# EAGLE design s0httpv9 (EAGLE 7.2.0)
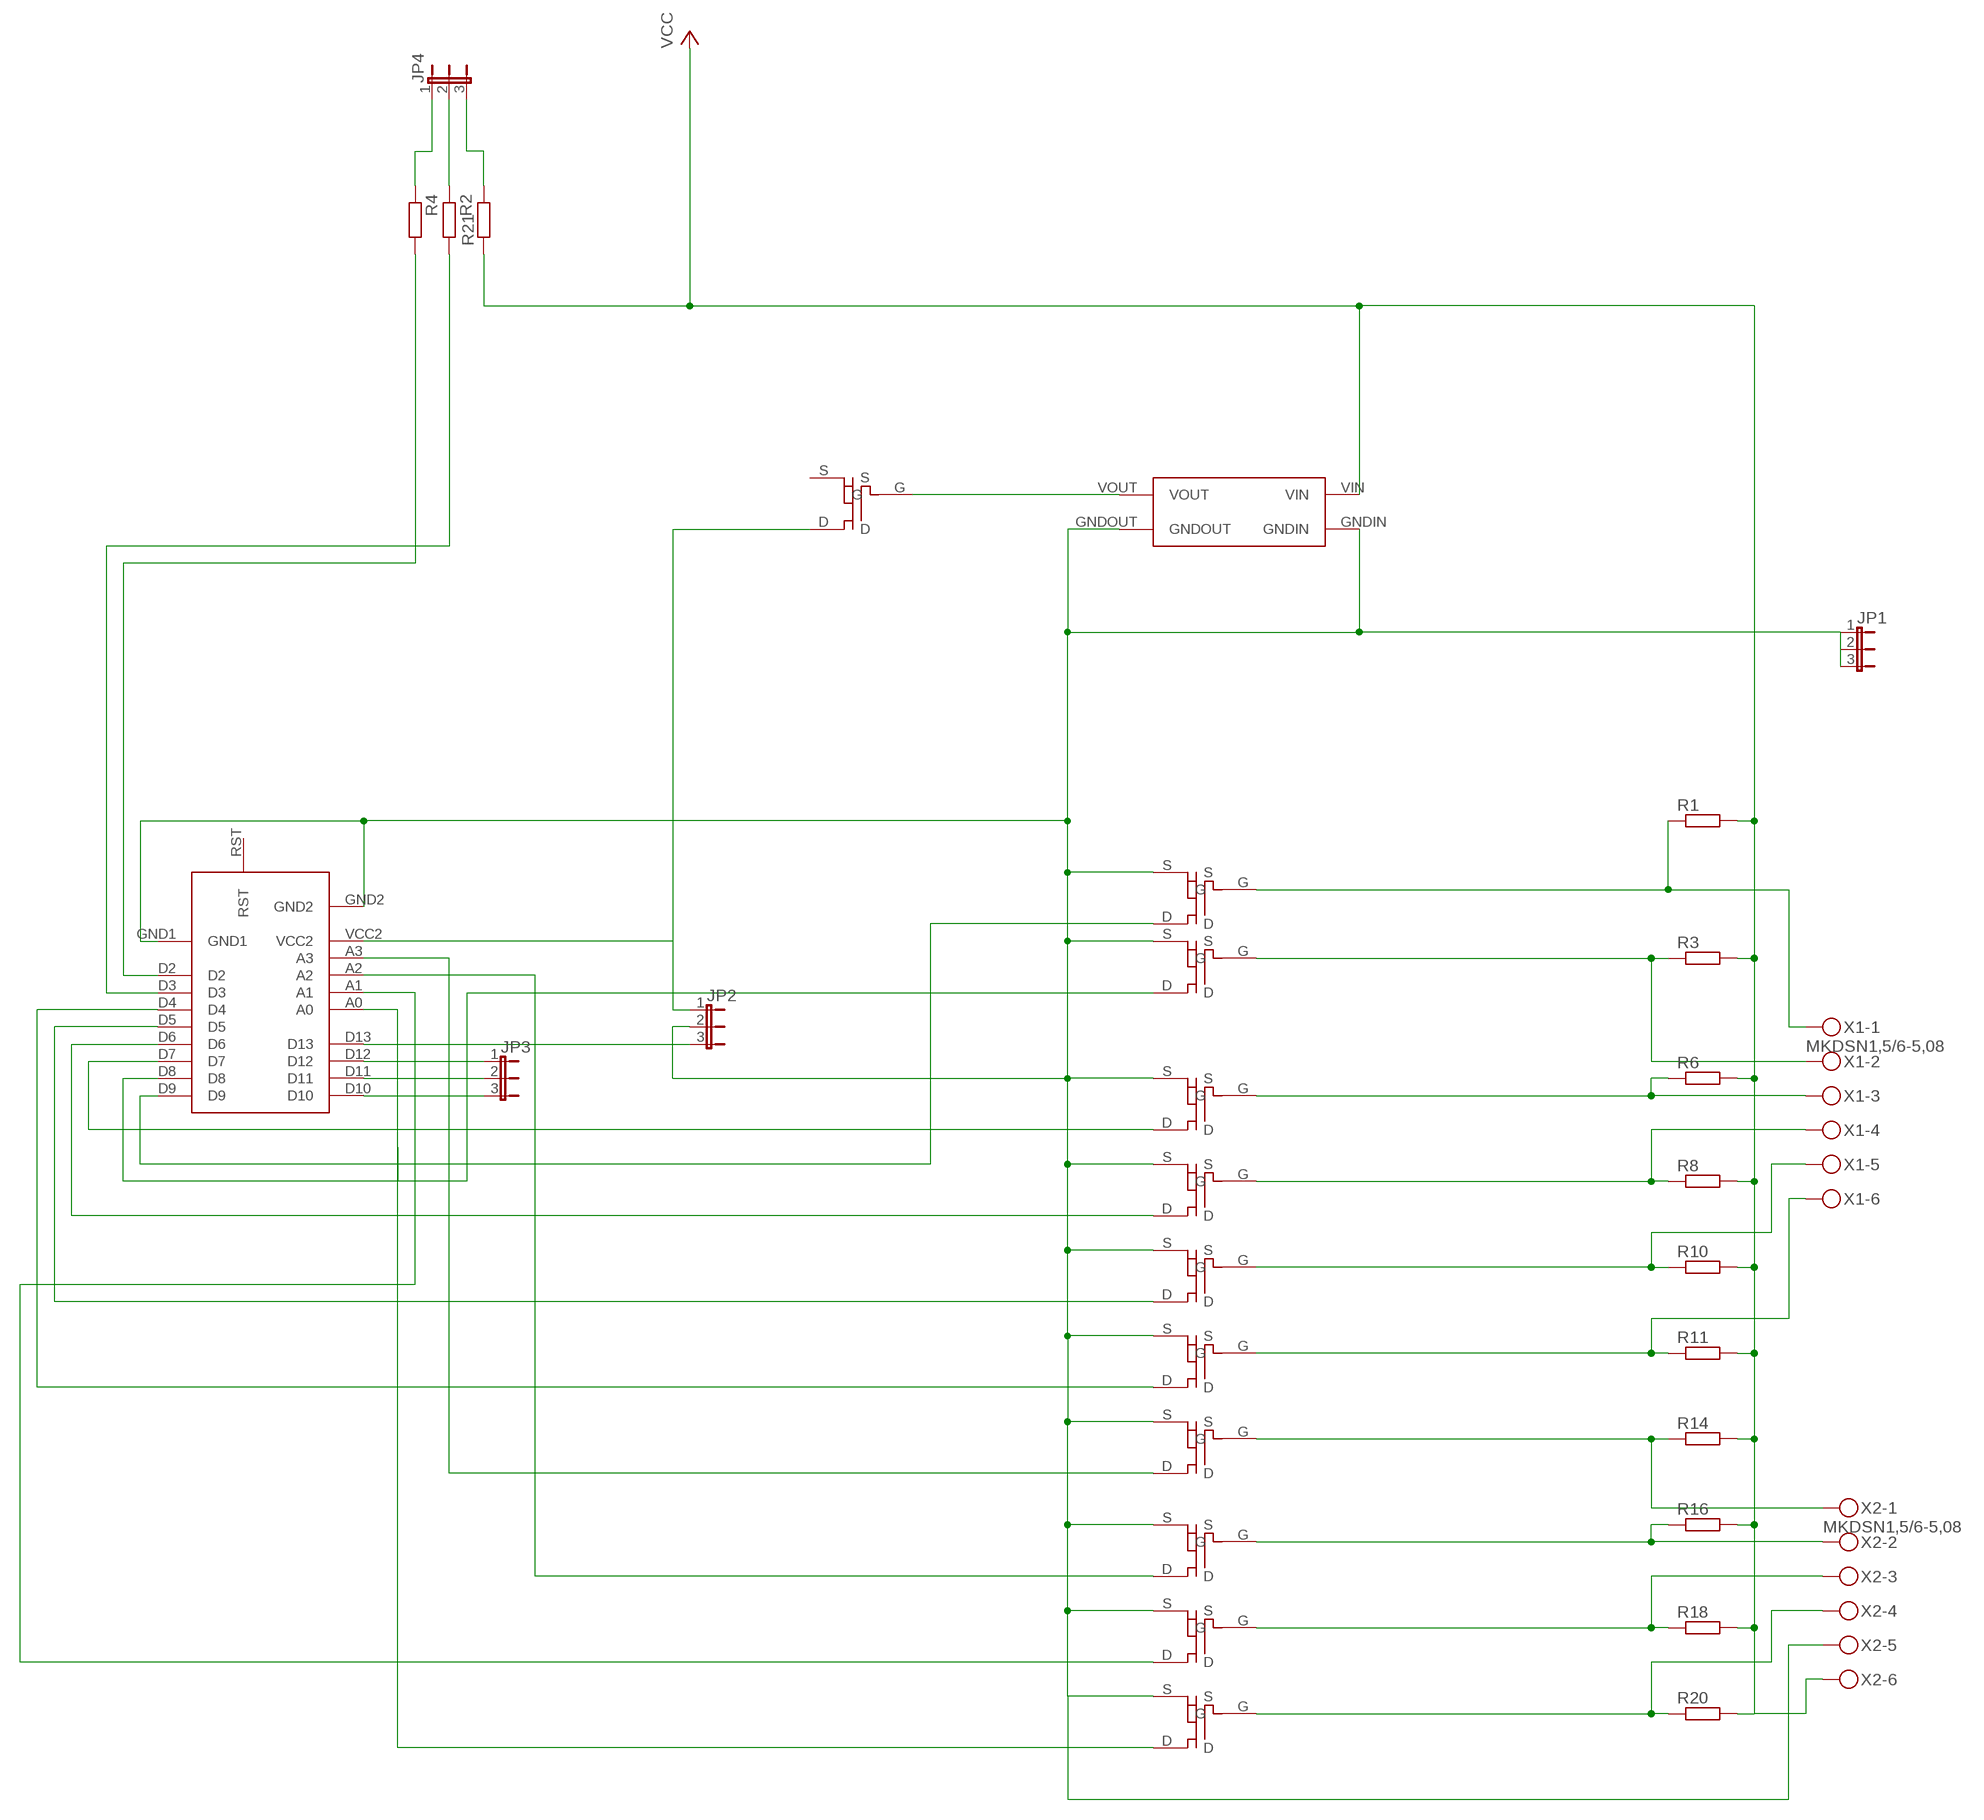
[diagram p0: schematic, sheet 1]

## Parts
JP1  JP2E  [JP2]
JP2  JP2E  [JP2]
JP3  JP2E  [JP2]
JP4  JP2E  [JP2]
R1  R-EU_R0805  [R0805]
R2  R-EU_R0805  [R0805]
R3  R-EU_R0805  [R0805]
R4  R-EU_R0805  [R0805]
R6  R-EU_R0805  [R0805]
R8  R-EU_R0805  [R0805]
R10  R-EU_R0805  [R0805]
R11  R-EU_R0805  [R0805]
R14  R-EU_R0805  [R0805]
R16  R-EU_R0805  [R0805]
R18  R-EU_R0805  [R0805]
R20  R-EU_R0805  [R0805]
R21  R-EU_R0805  [R0805]
U$1  ARDUINOPROMINIREDUCED  [ARDUINOPROMINIREDUCED]
U$2  VREGMODULE  [VREGMODULE]
U$3  MOSFET-TO236  [MOSFET-TO236]
U$4  MOSFET-TO236  [MOSFET-TO236]
U$5  MOSFET-TO236  [MOSFET-TO236]
U$6  MOSFET-TO236  [MOSFET-TO236]
U$7  MOSFET-TO236  [MOSFET-TO236]
U$8  MOSFET-TO236  [MOSFET-TO236]
U$9  MOSFET-TO236  [MOSFET-TO236]
U$10  MOSFET-TO236  [MOSFET-TO236]
U$11  MOSFET-TO236  [MOSFET-TO236]
U$12  MOSFET-TO236  [MOSFET-TO236]
U$13  MOSFET-TO236  [MOSFET-TO236]
X1  MKDSN1,5/6-5,08  [MKDSN1,5/6-5,08]
X2  MKDSN1,5/6-5,08  [MKDSN1,5/6-5,08]

## Nets
GND: JP1.1 JP1.2 JP1.3 JP2.2 U$1.GND1 U$1.GND2 U$2.GNDIN U$2.GNDOUT U$3.S U$4.S U$5.S U$6.S U$7.S U$8.S U$9.S U$10.S U$11.S U$12.S X2.5
N$1: R14.1 U$9.G X2.1
N$2: R10.1 U$7.G X1.5
N$3: JP3.3 U$1.D10
N$4: R16.1 U$10.G X2.2
N$5: R18.1 U$11.G X2.3
N$6: JP3.2 U$1.D11
N$7: JP3.1 U$1.D12
N$8: U$1.D8 U$4.D
N$9: JP2.3 U$1.D13
N$10: U$1.D9 U$3.D
N$12: JP2.1 U$1.VCC2 U$13.D
N$13: U$1.A3 U$9.D
N$14: U$1.D6 U$6.D
N$15: U$1.D5 U$7.D
N$16: U$1.A2 U$10.D
N$17: U$1.D4 U$8.D
N$18: U$1.D7 U$5.D
N$19: U$2.VOUT U$13.G
N$21: U$1.A0 U$12.D
N$22: R1.1 U$3.G X1.1
N$23: R3.1 U$4.G X1.2
N$24: U$1.A1 U$11.D
N$25: R6.1 U$5.G X1.3
N$27: R8.1 U$6.G X1.4
N$28: R11.1 U$8.G X1.6
N$29: JP4.3 R21.2
N$30: R20.1 U$12.G X2.4
N$33: JP4.1 R4.1
N$34: JP4.2 R2.1
N$35: R2.2 U$1.D3
N$37: R4.2 U$1.D2
VCC: R1.2 R3.2 R6.2 R8.2 R10.2 R11.2 R14.2 R16.2 R18.2 R20.2 R21.1 U$2.VIN X2.6
Unconnected: U$1.RST U$13.S

## Library data of the parts
JP1-JP4 = jumper:JP2E: JUMPER
R1-R4 R6 R8 R10 R11 R14 R16 R18 R20 R21 = resistor:R-EU_: RESISTOR, European symbol
U$1 = snulllib:ARDUINOPROMINIREDUCED
U$2 = snulllib:VREGMODULE
U$3-U$13 = snulllib:MOSFET-TO236
X1 X2 = con-phoenix-508:MKDSN1,5/6-5,08: MKDSN 1,5/ 6-5,08 Printklemme Nennstrom: 13,5 A Nennspannung: 250 V Rastermaß: 5,08 mm Polzahl: 6 Anschlussart: Schraubanschluss Montage: Löten Anschlussrichtung Leiter/Platine: 0 ° Artikelnummer: 1729160 Source: http://eshop.phoenixcontact.com .. 1729160.pdf

## Board
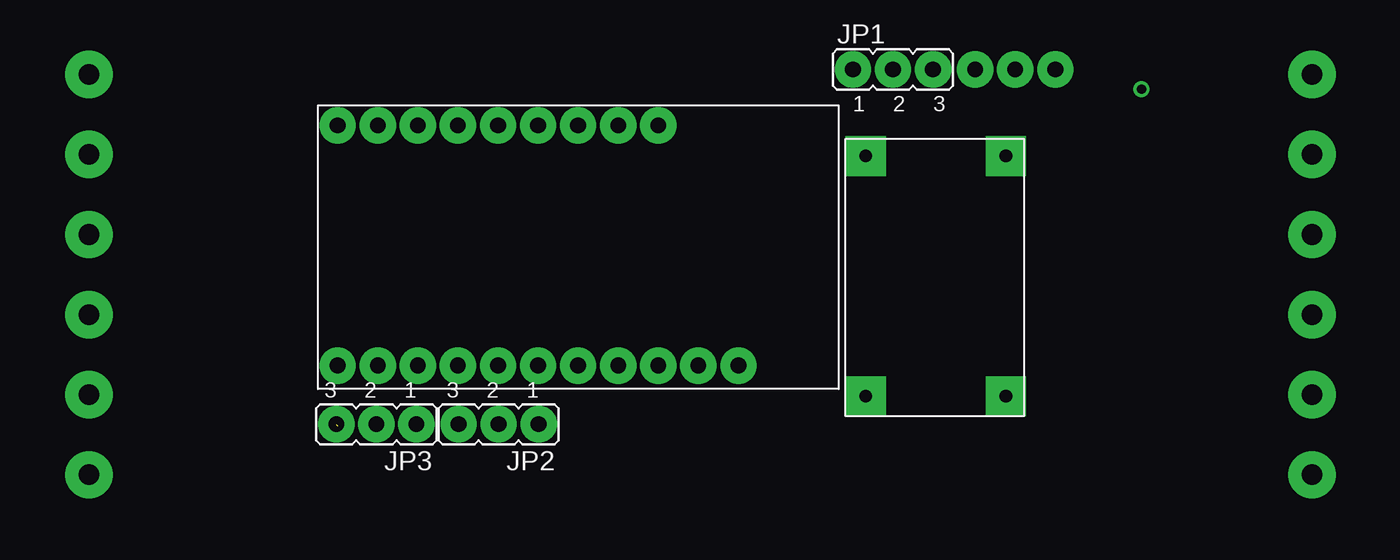
[diagram p1: board, top side]
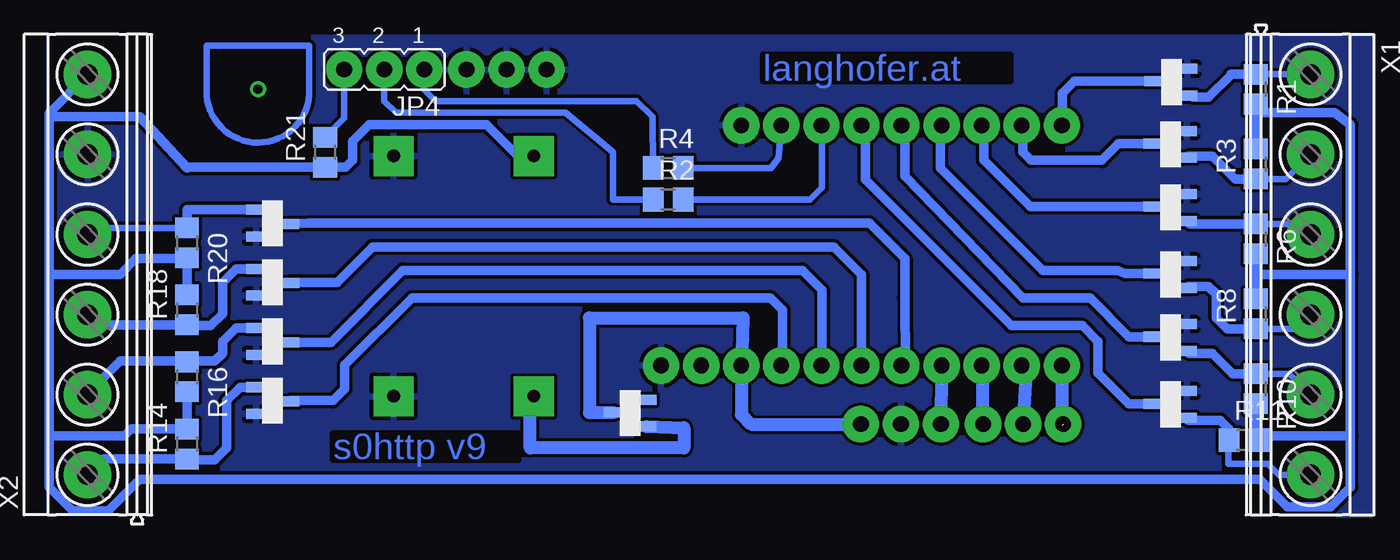
[diagram p2: board, bottom side, seen from below]

No outline drawn. Coordinates in mm, seen from the top.
Copper layers (1*16): Top 0.035mm / dielectric 1.5mm / Bottom 0.035mm
Design rules "default": minimum track width 10mil, minimum drill 24mil, track to track 8mil, track to pad 8mil, pad to pad 8mil, via to via 8mil, smd to smd 8mil, copper to edge 40mil, drill to drill 8mil, minimum pad ring 10mil, minimum via ring 8mil, stop-mask expansion 4mil, vias tented up to drill 0mil, thermal gap 10mil

### Footprints (pad centres in the part's own frame; a part is rotated, then mirrored left to right if it is on the bottom)
JP2 = drill 1 pad 2.3: 1 -2.54,0; 2 0,0; 3 2.54,0
R0805 = smd 1.3 x 1.5: 1 -0.95,0; 2 0.95,0
ARDUINOPROMINIREDUCED = drill 1 pad 2.3: A0 16.51,-21.59; A1 16.51,-19.05; A2 16.51,-16.51; A3 16.51,-13.97; D2 1.27,-13.97; D3 1.27,-16.51; D4 1.27,-19.05; D5 1.27,-21.59; D6 1.27,-24.13; D7 1.27,-26.67; D8 1.27,-29.21; D9 1.27,-31.75; D10 16.51,-31.75; D11 16.51,-29.21; D12 16.51,-26.67; D13 16.51,-24.13; GND1 1.27,-11.43; GND2 16.51,-6.35; RST 16.51,-8.89; VCC2 16.51,-11.43
VREGMODULE = drill 0.8 pad 2.54 square: GNDIN 16.51,-10.16; GNDOUT 1.27,-10.16; VIN 16.51,-1.27; VOUT 1.27,-1.27
MOSFET-TO236 = smd 0.635 x 1.27: D 1.5,1.73; G 0.6,-0.37; S 2.3,-0.37
MKDSN1,5/6-5,08 = drill 1.3 pad 3: 1 -12.7,0.025; 2 -7.62,0.025; 3 -2.54,0.025; 4 2.54,0.025; 5 7.62,0.025; 6 12.7,0.025

### Placement (x,y rotation side)
JP1  54.75,28.25 0 top
JP2  29.75,5.75 180 top
JP3  22,5.75 180 top
JP4  62.5,28.25 180 bottom
R1  7.25,27 270 bottom
R2  44.5,20 0 bottom
R3  7.25,22.25 90 bottom
R4  44.5,22 0 bottom
R6  7.25,17.5 270 bottom
R8  7.25,12.75 90 bottom
R10  7.25,8 270 bottom
R11  8,4.75 0 bottom
R14  75,4.5 90 bottom
R16  75,8.75 270 bottom
R18  75,13 90 bottom
R20  75,17.25 270 bottom
R21  66.25,23 90 bottom
U$1  51.3,25.98 270 top
U$2  51.75,6.25 90 top
U$3  11.95,26 90 bottom
U$4  12,22.05 90 bottom
U$5  12,18.05 90 bottom
U$6  12,13.8 90 bottom
U$7  12,9.8 90 bottom
U$8  12,5.55 90 bottom
U$9  70.25,8.7 270 bottom
U$10  70.25,12.45 270 bottom
U$11  70.25,16.2 270 bottom
U$12  70.25,19.95 270 bottom
U$13  46.25,5 90 bottom
X1  3.81,15.24 270 bottom
X2  81.28,15.24 90 bottom

### Tracks (layer width: path | path; a pad name or v marks a point on that pad's centre or on a via)
GND
  pour Bottom: 0,30.25 85.25,30.25 85.25,0 0,0
N$1
  Bottom 0.406: 80.3,3.55 X2.1 | 74.95,3.5 R14.1
  Bottom 0.61: R14.1 80.3,3.55 | U$9.G 71.65,8.1 72.5,7.25 72.5,4.25 73.25,3.5 74.95,3.5
N$2
  Bottom 0.406: R10.1 5.12,8.95 X1.5 | 11.48,10.25 U$7.G
  Bottom 0.61: R10.1 8.7,8.95 10,10.25 11.48,10.25
N$3  (1 unrouted)
  Bottom 0.813: U$1.D10 19.55,5.65
N$4
  Bottom 0.406: X2.2 81.31,7.7 | 75.05,9.75 R16.1 74.95,9.75
  Bottom 0.61: 81.31,7.7 79.25,9.75 75.05,9.75 | U$10.G 71.9,11.85 72.75,11 72.75,10.25 73.25,9.75 74.95,9.75
N$5
  Bottom 0.406: 80.66,12.05 X2.3 | 74.95,12 R18.1
  Bottom 0.61: R18.1 80.66,12.05 | U$11.G 71.9,15.6 72.75,14.75 72.75,12.75 73.5,12 74.95,12
N$6
  Bottom 0.813: U$1.D11 21.84,8.91 JP3.2
N$7
  Bottom 0.813: JP3.1 24.54,9.56 U$1.D12
N$8
  Bottom 0.406: 22,24.62 U$1.D8
  Bottom 0.61: U$4.D 15.95,23.55 17,22.5 21.5,22.5 22,23 22,24.62
N$9
  Bottom 0.813: U$1.D13 27.17,9.29 JP2.3
N$10
  Bottom 0.406: 19.5,24.76 U$1.D9
  Bottom 0.61: U$3.D 18.75,27.5 19.5,26.75 19.5,24.76
N$12
  Bottom 0.813: JP2.1 39.25,5.75 39.87,6.37 U$1.VCC2 39.87,9.37 39.75,12.5 49.5,12.5 49.5,6.5 U$13.D
N$13
  Bottom 0.254: 37.25,9.25 37.5,9.89 U$1.A3
  Bottom 0.305: 68.47,7.25 U$9.D
  Bottom 0.61: 37.25,9.25 37.25,13 38.02,13.77 49,13.75 60.75,13.75 65,9.5 65,8 65.75,7.25 68.47,7.25
N$14
  Bottom 0.406: 27.25,24.79 U$1.D6
  Bottom 0.61: U$6.D 15.55,15.3 16,15.5 20.75,15.5 27.25,22 27.25,24.79
N$15
  Bottom 0.406: 29.5,24.75 U$1.D5
  Bottom 0.61: U$7.D 15.3,11.3 17.75,13.75 22,13.75 29.5,21.5 29.5,24.75
N$16
  Bottom 0.61: U$1.A2 34.75,11.43 34.75,14.25 36,15.5 61.33,15.5 65.88,10.95 U$10.D
N$17
  Bottom 0.406: 32,24.71 U$1.D4
  Bottom 0.61: U$8.D 15.3,7.05 17.25,9 17.25,11 18.25,12 22.75,12 32,21.25 32,24.71
N$18
  Bottom 0.406: 24.5,24.84 U$1.D7
  Bottom 0.61: U$5.D 21.55,19.55 24.5,22.5 24.5,24.84
N$19
  Bottom 0.813: 53.79,7.5 U$2.VOUT 53.27,7.27 53.25,4.25 43.5,4.25 43.5,5.53 U$13.G
N$21
  Bottom 0.254: 29.46,9.46 U$1.A0
  Bottom 0.61: U$12.D 67.33,18.5 31.75,18.5 29.5,16.25 29.5,13.75 29.46,9.46
N$22
  Bottom 0.406: R1.1 X1.1 | 8.85,27.95 8.85,27.9 | 11.23,26.5 U$3.G
  Bottom 0.61: 8.85,27.95 R1.1 | 8.85,27.9 10.25,26.5 11.23,26.5
N$23
  Bottom 0.406: R3.1 5.34,21.3 X1.2 | 11.53,22.75 U$4.G
  Bottom 0.61: R3.1 8.55,21.3 10,22.75 11.53,22.75
N$24
  Bottom 0.305: 68.47,14.75 U$11.D
  Bottom 0.61: U$1.A1 32.25,15.25 34,17 63.25,17 65.5,14.75 68.47,14.75
N$25
  Bottom 0.406: R6.1 4.46,18.45 X1.3 | 11.43,18.45 U$5.G
  Bottom 0.61: R6.1 11.43,18.45
N$26
  Bottom 0.406: 67.25,29.75 67.25,27 arc189 73.75,27.25 73.75,29.75 67.25,29.75
N$27
  Bottom 0.406: R8.1 4.68,11.8 X1.4 | 11.53,14.5 U$6.G
  Bottom 0.61: R8.1 9.05,11.8 9.75,12.5 9.75,14 10.25,14.5 11.53,14.5
N$28
  Bottom 0.406: X1.6 5.79,2.54 6.5,3.25 9,3.25 9,4.7 R11.1 | 11.53,6 U$8.G
  Bottom 0.61: R11.1 8.95,5.45 9.5,6 11.53,6
N$29
  Bottom 0.406: R21.2 65.04,25.16 JP4.3
N$30
  Bottom 0.406: R20.1 81.31,18.2 X2.4
  Bottom 0.61: U$12.G 75,19.35 R20.1
N$33
  Bottom 0.406: R4.1 45.5,25.25 46.5,26.25 59.25,26.25 59.96,26.96 JP4.1
N$34
  Bottom 0.406: R2.1 48,20 48,23 51,25.5 61.75,25.5 62.5,26.25 JP4.2
N$35
  Bottom 0.406: U$1.D3 34.75,24.42 34.75,20.75 35.5,20 R2.2
N$37
  Bottom 0.406: U$1.D2 37.5,22.63 38,22 R4.2
N$46  (via drill 0.6)
  other vias: 70.5,27
VCC
  Bottom 0.406: X2.6 81.14,27.77
  Bottom 0.61: 83.75,15.25 79.25,15.25 78.25,16.25 75.05,16.25 R20.2 R18.2 | X2.6 83.75,25.5 83.75,25.25 | 83.75,5 79,5 78.55,5.45 R14.2 R16.2 | 83.75,5 83.75,15.25 | 83.75,15.25 83.75,25.25 | 83.75,5 83.75,1.75 82.25,0.25 80,0.25 78,2.25 7,2.25 5.25,0.5 2.5,0.5 1.25,1.75 1.25,5 | 1.25,5 1.25,15.25 | 1.25,15.25 1.25,24.75 2.25,25.5 7.25,25.5 | R3.2 7.25,25.5 | 7.25,25.5 R1.2 | R8.2 R6.2 7.25,15.25 1.25,15.25 | 7.25,5 R10.2 | R11.2 7.25,5 | 7.25,5 1.25,5 | 83.75,25.25 78,25.25 75,22 74.95,22.05 R21.1 64.95,22.05 64.5,22.5 64.5,23.7 63.45,24.75 56,24.75 54.01,22.76 U$2.VIN

### Text on the board
Bottom: langhofer.at | s0http v9